# Altium schematic sheet Complete.SchDoc
size A4; SheetNumber: 1; SheetTotal: 3
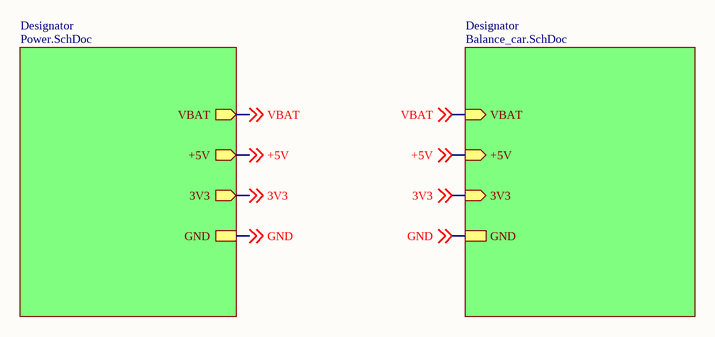
[diagram p0: Complete.SchDoc]

## Sub-sheets
Designator = Power.SchDoc: VBAT (out), +5V (out), GND, 3V3 (out)
Designator = Balance_car.SchDoc: VBAT (in), +5V (in), GND, 3V3 (in)

## Nets
3V3: off-sheet 3V3, sheet Designator/3V3, sheet Designator/3V3
+5V: off-sheet +5V, sheet Designator/+5V, sheet Designator/+5V
GND: off-sheet GND, sheet Designator/GND, sheet Designator/GND
VBAT: off-sheet VBAT, sheet Designator/VBAT, sheet Designator/VBAT